# Altium schematic sheet MCU.SchDoc
size A3; SheetNumber: 2; SheetTotal: 6
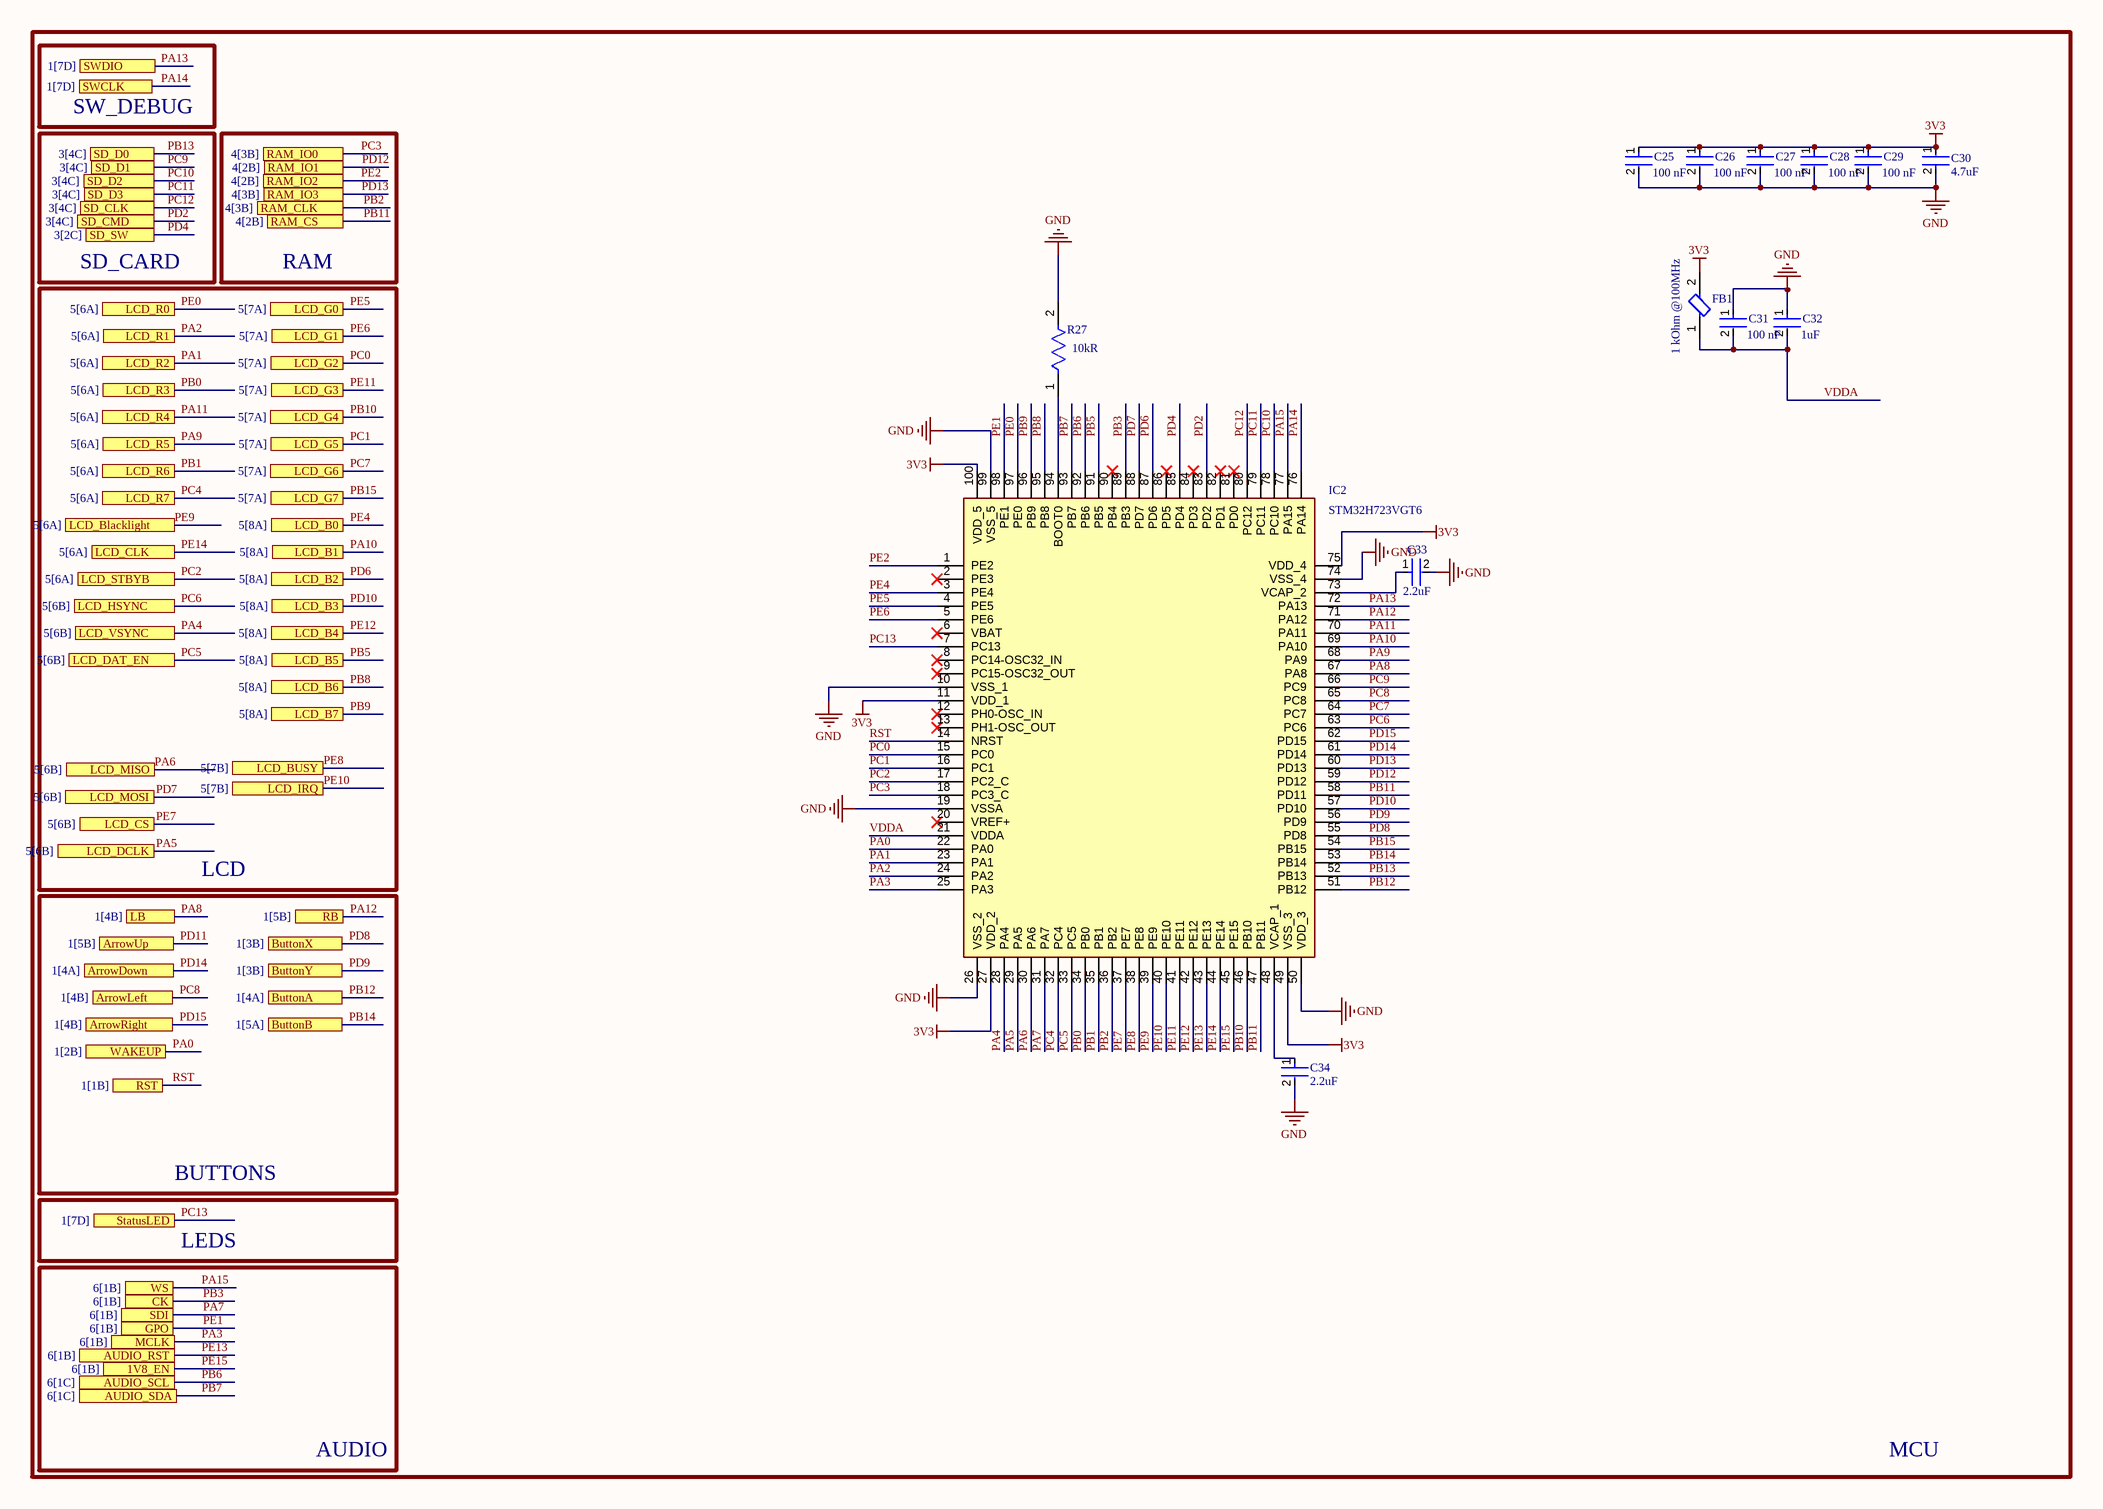
[diagram p0: MCU.SchDoc]

## Parts
C25  value 100 nF  [FP-AC0402-0_5-MFG]  (hidden comment: AC0402KRX7R7BB104)
C26  value 100 nF  [FP-AC0402-0_5-MFG]  (hidden comment: AC0402KRX7R7BB104)
C27  value 100 nF  [FP-AC0402-0_5-MFG]  (hidden comment: AC0402KRX7R7BB104)
C28  value 100 nF  [FP-AC0402-0_5-MFG]  (hidden comment: AC0402KRX7R7BB104)
C29  value 100 nF  [FP-AC0402-0_5-MFG]  (hidden comment: AC0402KRX7R7BB104)
C30  Capacitance: 4.7uF  [FP-0402-L_1_0_0_15-W_0_5-IPC_B]  (hidden comment: JMK105BBJ475MVHF)
C31  value 100 nF  [FP-AC0402-0_5-MFG]  (hidden comment: AC0402KRX7R7BB104)
C32  Capacitance: 1uF  [FP-GRM155-0_1-IPC_A]  (hidden comment: GRM155C70J105KE11D)
C33  Capacitance: 2.2uF  [FP-GRM155-0_2-IPC_B]  (hidden comment: GRM155R61C225KE11D)
C34  Capacitance: 2.2uF  [FP-GRM155-0_2-IPC_B]  (hidden comment: GRM155R61C225KE11D)
FB1  value 1 kOhm @100MHz  [FP-BLM21-0_2-t0_85-e0_5-d-IPC_A]  (hidden comment: BLM21SP102SN1D)
IC2  STM32H723VGT6  [QFP50P1600X1600X160-100N]
R27  Resistance: 10kR  [FP-RK73H1E-IPC_C]  (hidden comment: RK73H1ETTPD1002F)

## Ports
1V8_EN (see 6[1B]), ArrowDown (see 1[4A]), ArrowLeft (see 1[4B]), ArrowRight (see 1[4B]), ArrowUp (see 1[5B]), AUDIO_RST (see 6[1B]), AUDIO_SCL (see 6[1C]), AUDIO_SDA (see 6[1C]), ButtonA (see 1[4A]), ButtonB (see 1[5A]), ButtonX (see 1[3B]), ButtonY (see 1[3B]), CK (see 6[1B]), GPO (see 6[1B]), LB (see 1[4B]), LCD_B0 (see 5[8A]), LCD_B1 (see 5[8A]), LCD_B2 (see 5[8A]), LCD_B3 (see 5[8A]), LCD_B4 (see 5[8A]), LCD_B5 (see 5[8A]), LCD_B6 (see 5[8A]), LCD_B7 (see 5[8A]), LCD_Blacklight (see 5[6A]), LCD_BUSY (see 5[7B]), LCD_CLK (see 5[6A]), LCD_CS (see 5[6B]), LCD_DAT_EN (see 5[6B]), LCD_DCLK (see 5[6B]), LCD_G0 (see 5[7A]), LCD_G1 (see 5[7A]), LCD_G2 (see 5[7A]), LCD_G3 (see 5[7A]), LCD_G4 (see 5[7A]), LCD_G5 (see 5[7A]), LCD_G6 (see 5[7A]), LCD_G7 (see 5[7A]), LCD_HSYNC (see 5[6B]), LCD_IRQ (see 5[7B]), LCD_MISO (see 5[6B]), LCD_MOSI (see 5[6B]), LCD_R0 (see 5[6A]), LCD_R1 (see 5[6A]), LCD_R2 (see 5[6A]), LCD_R3 (see 5[6A]), LCD_R4 (see 5[6A]), LCD_R5 (see 5[6A]), LCD_R6 (see 5[6A]), LCD_R7 (see 5[6A]), LCD_STBYB (see 5[6A]), LCD_VSYNC (see 5[6B]), MCLK (see 6[1B]), RAM_CLK (see 4[3B]), RAM_CS (see 4[2B]), RAM_IO0 (see 4[3B]), RAM_IO1 (see 4[2B]), RAM_IO2 (see 4[2B]), RAM_IO3 (see 4[3B]), RB (see 1[5B]), RST (see 1[1B]), SD_CLK (see 3[4C]), SD_CMD (see 3[4C]), SD_D0 (see 3[4C]), SD_D1 (see 3[4C]), SD_D2 (see 3[4C]), SD_D3 (see 3[4C]), SD_SW (see 3[2C]), SDI (see 6[1B]), StatusLED (see 1[7D]), SWCLK (see 1[7D]), SWDIO (see 1[7D]), WAKEUP (see 1[2B]), WS (see 6[1B])

## Nets
3V3: C25.1 C26.1 C27.1 C28.1 C29.1 C30.1 FB1.2 IC2.11(VDD_1) IC2.27(VDD_2) IC2.49(VSS_3) IC2.75(VDD_4) IC2.100(VDD_5)
GND: C25.2 C26.2 C27.2 C28.2 C29.2 C30.2 C31.1 C32.1 C33.2 C34.2 IC2.10(VSS_1) IC2.19(VSSA) IC2.26(VSS_2) IC2.50(VDD_3) IC2.74(VSS_4) IC2.99(VSS_5) R27.2
PA0: IC2.22(PA0) ; port WAKEUP
PA1: IC2.23(PA1) ; port LCD_R2
PA2: IC2.24(PA2) ; port LCD_R1
PA3: IC2.25(PA3) ; port MCLK
PA4: IC2.28(PA4) ; port LCD_VSYNC
PA5: IC2.29(PA5) ; port LCD_DCLK
PA6: IC2.30(PA6) ; port LCD_MISO
PA7: IC2.31(PA7) ; port SDI
PA8: IC2.67(PA8) ; port LB
PA9: IC2.68(PA9) ; port LCD_R5
PA10: IC2.69(PA10) ; port LCD_B1
PA11: IC2.70(PA11) ; port LCD_R4
PA12: IC2.71(PA12) ; port RB
PA13: IC2.72(PA13) ; port SWDIO
PA14: IC2.76(PA14) ; port SWCLK
PA15: IC2.77(PA15) ; port WS
PB0: IC2.34(PB0) ; port LCD_R3
PB1: IC2.35(PB1) ; port LCD_R6
PB2: IC2.36(PB2) ; port RAM_CLK
PB3: IC2.89(PB3) ; port CK
PB5: IC2.91(PB5) ; port LCD_B5
PB6: IC2.92(PB6) ; port AUDIO_SCL
PB7: IC2.93(PB7) ; port AUDIO_SDA
PB8: IC2.95(PB8) ; port LCD_B6
PB9: IC2.96(PB9) ; port LCD_B7
PB10: IC2.46(PB10) ; port LCD_G4
PB11: IC2.47(PB11) IC2.58(PD11) ; port RAM_CS
PB12: IC2.51(PB12) ; port ButtonA
PB13: IC2.52(PB13) ; port SD_D0
PB14: IC2.53(PB14) ; port ButtonB
PB15: IC2.54(PB15) ; port LCD_G7
PC0: IC2.15(PC0) ; port LCD_G2
PC1: IC2.16(PC1) ; port LCD_G5
PC2: IC2.17(PC2_C) ; port LCD_STBYB
PC3: IC2.18(PC3_C) ; port RAM_IO0
PC4: IC2.32(PC4) ; port LCD_R7
PC5: IC2.33(PC5) ; port LCD_DAT_EN
PC6: IC2.63(PC6) ; port LCD_HSYNC
PC7: IC2.64(PC7) ; port LCD_G6
PC8: IC2.65(PC8) ; port ArrowLeft
PC9: IC2.66(PC9) ; port SD_D1
PC10: IC2.78(PC10) ; port SD_D2
PC11: IC2.79(PC11) ; port SD_D3
PC12: IC2.80(PC12) ; port SD_CLK
PC13: IC2.7(PC13) ; port StatusLED
PD2: IC2.83(PD2) ; port SD_CMD
PD4: IC2.85(PD4) ; port SD_SW
PD6: IC2.87(PD6) ; port LCD_B2
PD7: IC2.88(PD7) ; port LCD_MOSI
PD8: IC2.55(PD8) ; port ButtonX
PD9: IC2.56(PD9) ; port ButtonY
PD10: IC2.57(PD10) ; port LCD_B3
PD11: port ArrowUp
PD12: IC2.59(PD12) ; port RAM_IO1
PD13: IC2.60(PD13) ; port RAM_IO3
PD14: IC2.61(PD14) ; port ArrowDown
PD15: IC2.62(PD15) ; port ArrowRight
PE0: IC2.97(PE0) ; port LCD_R0
PE1: IC2.98(PE1) ; port GPO
PE2: IC2.1(PE2) ; port RAM_IO2
PE4: IC2.3(PE4) ; port LCD_B0
PE5: IC2.4(PE5) ; port LCD_G0
PE6: IC2.5(PE6) ; port LCD_G1
PE7: IC2.37(PE7) ; port LCD_CS
PE8: IC2.38(PE8) ; port LCD_BUSY
PE9: IC2.39(PE9) ; port LCD_Blacklight
PE10: IC2.40(PE10) ; port LCD_IRQ
PE11: IC2.41(PE11) ; port LCD_G3
PE12: IC2.42(PE12) ; port LCD_B4
PE13: IC2.43(PE13) ; port AUDIO_RST
PE14: IC2.44(PE14) ; port LCD_CLK
PE15: IC2.45(PE15) ; port 1V8_EN
RST: IC2.14(NRST) ; port RST
VDDA: C31.2 C32.2 FB1.1 IC2.21(VDDA)
NetC33_1: C33.1 IC2.73(VCAP_2)
NetC34_1: C34.1 IC2.48(VCAP_1)
NetIC2_94: IC2.94(BOOT0) R27.1

Not connected (* = marked no-connect by the designer): IC2 2(PE3)* 6(VBAT)* 8(PC14-OSC32_IN)* 9(PC15-OSC32_OUT)* 12(PH0-OSC_IN)* 13(PH1-OSC_OUT)* 20(VREF+)* 81(PD0)* 82(PD1)* 84(PD3)* 86(PD5)* 90(PB4)*

## Notes on the sheet
- SW_DEBUG
- SD_CARD
- RAM
- LCD
- BUTTONS
- LEDS
- AUDIO
- MCU
- DWG NO:
- REV:
- THIS DOCUMENT AND THE DATA DISCLOSED HEREIN OR
- HEREWITH IS THE PROPERTY OF ALTIUM LIMITED AND MAY
- BE FREELY DISTRIBUTED IN WHOLE. NO RIGHTS ARE
- RESERVED OR EXPRESS OR IMPLIED WARANTEE GIVEN.
- REVISION
- DESCRIPTION
- DATE
- APPROVED
- ENG:
- APPROVALS
- PROJECT
- DSN:
- CHK:
- REFERENCE DOCUMENTS
- PROJECT REVISION:
- TITLE
- DOCUMENT REVISION:
- DESIGN ITEM:
- BOM:
- FAB DWG:
- PCB DWG:
- ASSY DWG:
- SCALE:
- A2
- SIZE
- CAGE CODE
- FILE NAME
- DWG NO.
- SHEET
- OF
- REV

## Library data of the parts
C25-C29 C31 = CMP-03422-000136-1: 0.10µF 16V Ceramic Capacitor X7R 0402 (1005 Metric) 0.039" L x 0.020" W (1.00mm x 0.50mm); Manufacturer: Yageo; Tolerance: 0.1; Automotive Grade: Grade 1; Temperature Coefficient: ±15%; Description: AC0402 100 nF X7R 10.00% 16 V; Height: 0.55mm; Device Class L1: Passive Components; Voltage Rating: 16 V; Category: Cap; Package: AC0402-0.5; Mouser Description: AC Series 0402 0.1 uF 16V ±10% X7R Multilayer Ceramic Capacitor; Octopart: https://octopart.com/ac0402krx7r7bb104-yageo-71334186; Device Class L3: Ceramic Capacitors; Ipc Land Pattern Name: CAPC10050X50; Manufacturer Part Number: AC0402KRX7R7BB104; Footprint Url: http://www.yageo.com/exep/pages/download/literatures/UPY-C_GEN_24.pdf; Temperature: -55°C to +125°C; Material: Ceramic; RoHS: TRUE; ComponentLink2URL: http://www.yageo.com/documents/recent/UPY-AC_NP0X7R_16V-to-630V_12.pdf; Lead Free: Yes; Digikey Description: 0.10µF 16V Ceramic Capacitor X7R 0402 (1005 Metric) 0.039" L x 0.020" W (1.00mm x 0.50mm); Device Class L2: Capacitors; Temperature Range Low: -55°C; ComponentLink2Description: Datasheet; Capacitance: 100 nF; Temperature Characteristic: X7R; Automotive: Yes; Temperature Range High: +125°C
C30 = CMP-14477-001359-2: None; Voltage Rating (DC): 6.3V; Dielectric: X5R; Tolerance: 20%; Width: 0.5mm; Package Quantity: 10000; Thickness: 0.026inch; Halogen Free: Halogen Free; Weight: 2.3E-05oz; Ratings: AEC-Q200; Case/Package: 0402; Contact Plating: Tin; Length: 1mm; Lead Free: Lead Free; Case Code (Imperial): 0402; Termination: SMD/SMT; RoHS Compliant: Yes; Max Operating Temperature: 85°C; Mount: Surface Mount; Packaging: Tape and Reel; Min Operating Temperature: -55°C; Case Code (Metric): 1005; Voltage Rating: 6.3V; Height: 0.5mm
C32 = CMP-06035-005209-1: Chip Multilayer Ceramic Capacitors for General Purpose, 0402, 1.0uF, X7S, 22%, 10%, 6.3V; Thickness: 500um; Length: 1mm; Width: 500um; Tolerance: 10%; Dielectric: X7S; Voltage Rating (DC): 6.3V
C33 C34 = CMP-06035-001793-1: Chip Multilayer Ceramic Capacitors for General Purpose, 0402, 2.2uF, X5R, 15%, 10%, 16V; Tolerance: 10%; Packaging: Tape and Reel; Lead Free: Lead Free; Mount: Surface Mount; Width: 0.02inch; Case/Package: 0402; Case Code (Metric): 1005; Thickness: 0.022inch; Max Operating Temperature: 85°C; Min Operating Temperature: -55°C; Voltage Rating: 16V; Voltage Rating (DC): 16V; Material: Ceramic; Height: 0.3mm; Case Code (Imperial): 0402; Length: 0.039inch
FB1 = CMP-06046-001860-1: Chip Ferrite Bead, 0805, 1000Ω @ 100MHz, 0.12Ω, 25%, 1.6A; RoHS Compliant: Yes
IC2 = STM32H723VGT6: Integrated Circuit; Manufacturer_Name: STMicroelectronics; Datasheet Link: https://www.arrow.com/en/products/stm32h723vgt6/stmicroelectronics; Height: 1.6mm; Manufacturer_Part_Number: STM32H723VGT6; Mouser Part Number: 511-STM32H723VGT6; Mouser Price/Stock: https://www.mouser.co.uk/ProductDetail/STMicroelectronics/STM32H723VGT6?qs=sPbYRqrBIVmhrTQw3EmwTA%3D%3D; Arrow Part Number: STM32H723VGT6; Arrow Price/Stock: https://www.arrow.com/en/products/stm32h723vgt6/stmicroelectronics?utm_currency=USD&region=nac
R27 = CMP-04015-078367-1: 10kΩ ±1% 0.1W Chip Resistor 0402 Thick Film AEC-Q200 Qualified; Temperature Coefficient: 100ppm/°C; Power Rating: 62.5mW; Voltage Rating (DC): 50V; Width: 500um; Case/Package: 0402; Length: 1mm